# EAGLE schematic sender (EAGLE 7.1.0)
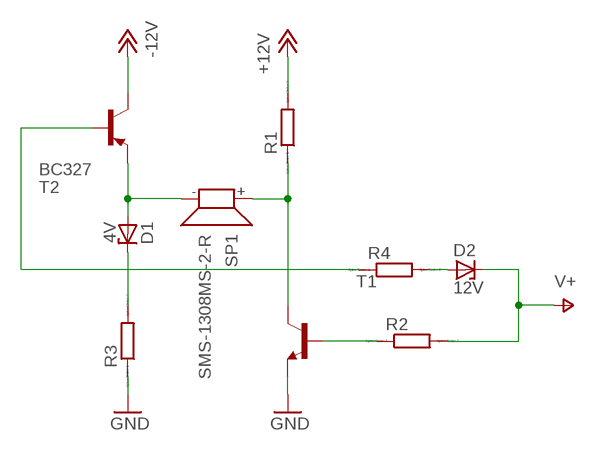
[diagram p0: schematic, sheet 1]

## Parts
D1  4V  ZENER-DIODEC1702-15  [C1702-15]
D2  12V  ZENER-DIODEC1702-15  [C1702-15]
R1  R-EU_0204_7  [0204/7]
R2  R-EU_0204_7  [0204/7]
R3  R-EU_0204_7  [0204/7]
R4  R-EU_0204_7  [0204/7]
SP1  SMS-1308MS-2-R  [SMS-1308MS-2-R]
T1  -NPN-TO92L  [TO92L]
T2  BC327  [TO92]

## Nets
+12V: R1.2
-12V: T2.3(C)
GND: R3.1 T1.1(E)
N$1: R1.1 SP1.+ T1.3(C)
N$2: R2.1 T1.2(B)
N$3: D1.C R3.2
N$4: D1.A SP1.- T2.1(E)
N$5: D2.A R4.2
N$6: R4.1 T2.2(B)
V+: D2.C R2.2

## Library data of the parts
D1 D2 = diode:ZENER-DIODE: Z-Diode
R1-R4 = resistor:R-EU_: RESISTOR, European symbol; SPICEPREFIX: R
SP1 = speaker:SMS-1308MS-2-R: Speaker 13 x 13mm, 8 Ohm, 0.7W Source: pui audio inc. SMS-1308MS-2-R.pdf
T1 = transistor:*-NPN-: NPN Transistror BF959 corrected 2008.03.06
T2 = transistor-pnp:BC327: PNP Transistor